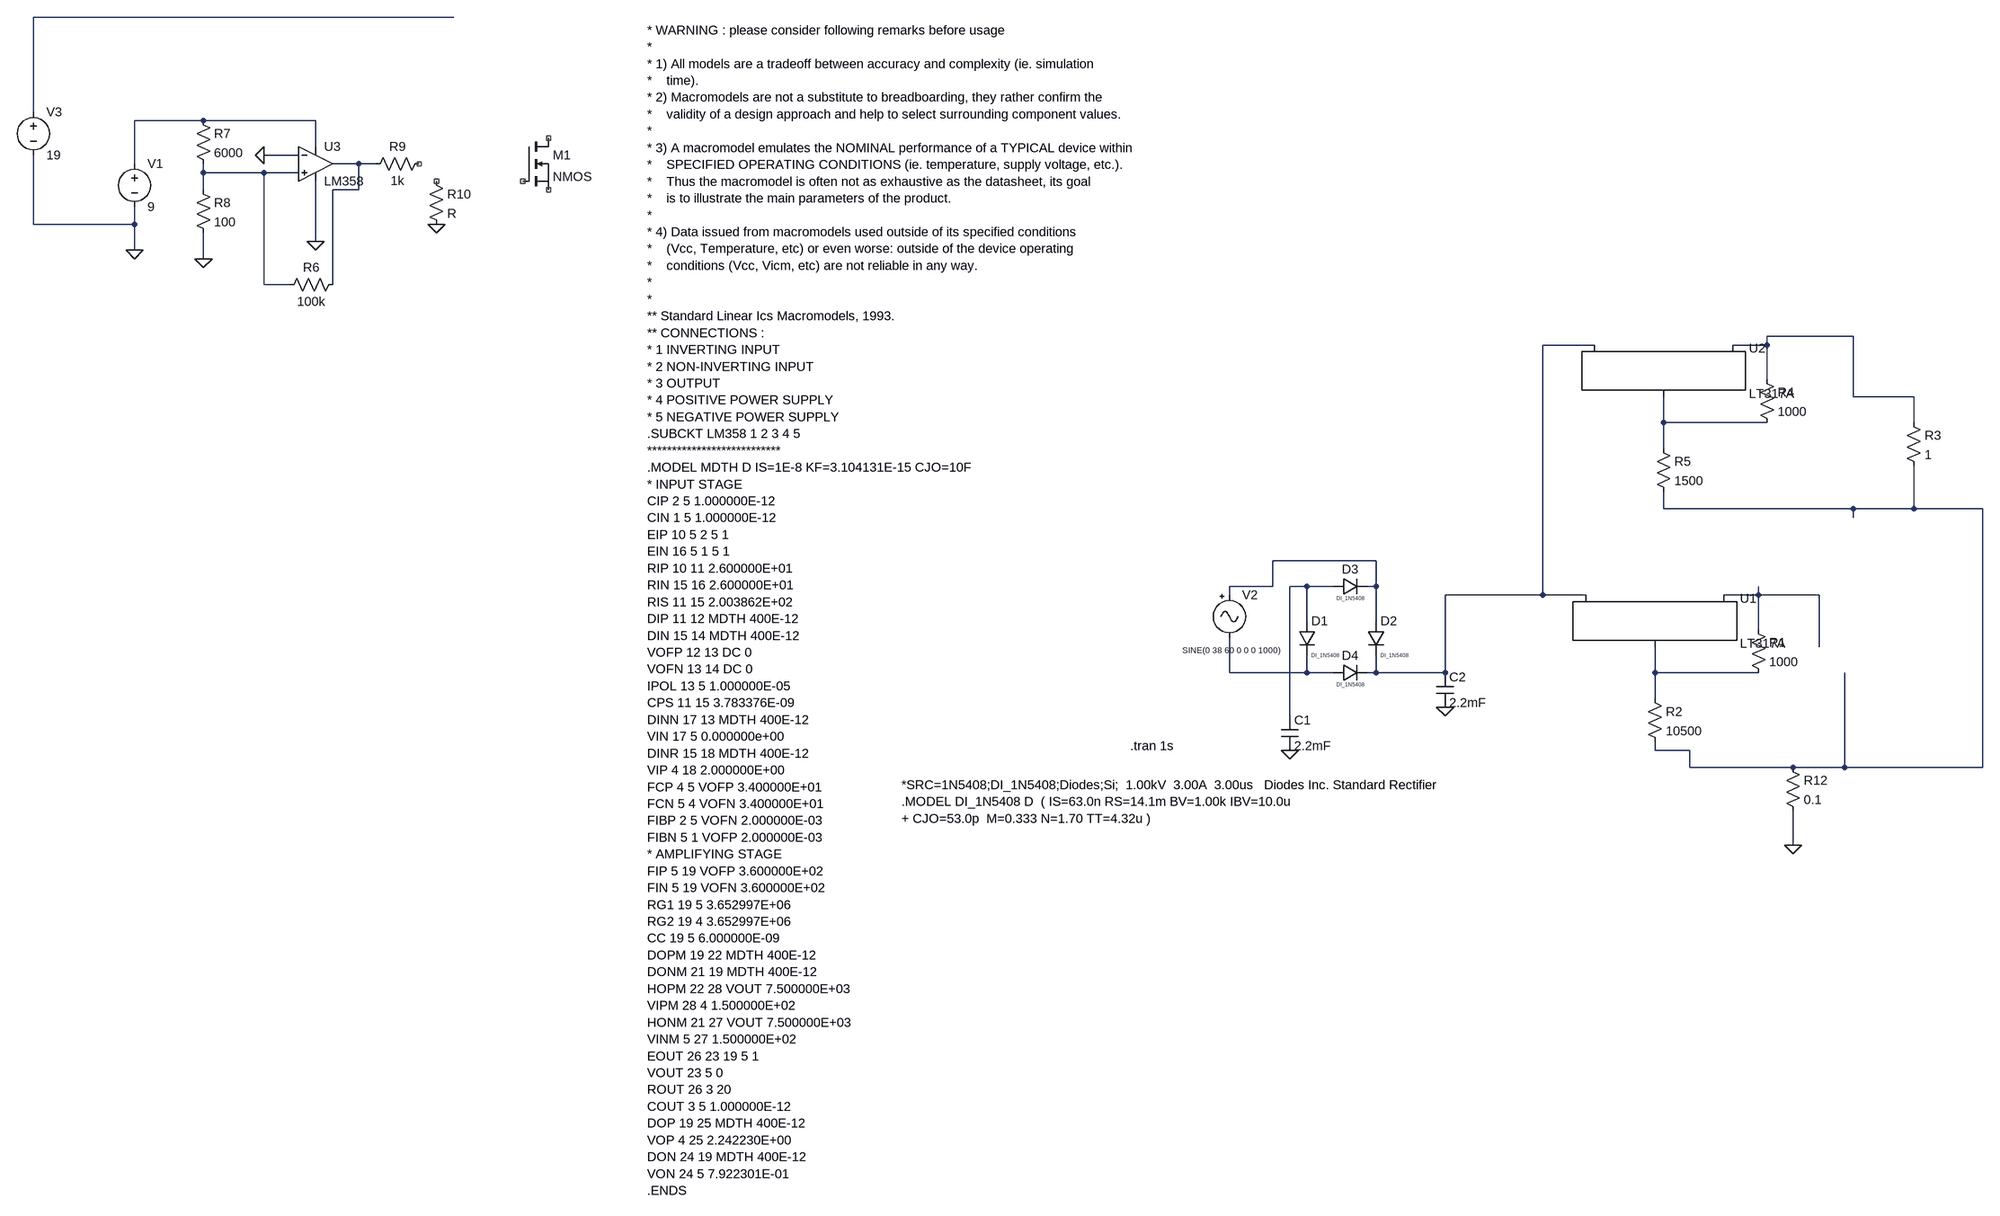
[diagram p0: schematic EjemploEstrella.asc]
EjemploEstrella.asc, the LTspice schematic file:
Version 4.1
SHEET 1 880 680
WIRE -2752 -1296 -3568 -1296
WIRE -3568 -1120 -3568 -1296
WIRE -3216 -1104 -3344 -1104
WIRE -3008 -1104 -3216 -1104
WIRE -3008 -1056 -3008 -1104
WIRE -3040 -1040 -3104 -1040
WIRE -3344 -1024 -3344 -1104
WIRE -2928 -1024 -2976 -1024
WIRE -2896 -1024 -2928 -1024
WIRE -3216 -1008 -3216 -1024
WIRE -3104 -1008 -3216 -1008
WIRE -3040 -1008 -3104 -1008
WIRE -3216 -976 -3216 -1008
WIRE -2928 -976 -2928 -1024
WIRE -2928 -976 -2976 -976
WIRE -3568 -912 -3568 -1040
WIRE -3344 -912 -3344 -944
WIRE -3344 -912 -3568 -912
WIRE -3008 -880 -3008 -992
WIRE -3344 -864 -3344 -912
WIRE -3216 -848 -3216 -896
WIRE -3104 -800 -3104 -1008
WIRE -3056 -800 -3104 -800
WIRE -2976 -800 -2976 -976
WIRE 224 -704 64 -704
WIRE -256 -688 -352 -688
WIRE 64 -688 64 -704
WIRE 64 -688 0 -688
WIRE 64 -624 64 -688
WIRE 224 -592 224 -704
WIRE 336 -592 224 -592
WIRE -128 -544 -128 -592
WIRE 64 -544 -128 -544
WIRE 336 -544 336 -592
WIRE -128 -496 -128 -544
WIRE -128 -384 -128 -416
WIRE 224 -384 -128 -384
WIRE 336 -384 336 -464
WIRE 336 -384 224 -384
WIRE 464 -384 336 -384
WIRE 224 -368 224 -384
WIRE -928 -288 -1120 -288
WIRE -1120 -240 -1120 -288
WIRE -1120 -240 -1200 -240
WIRE -1056 -240 -1088 -240
WIRE -1008 -240 -1056 -240
WIRE -928 -240 -928 -288
WIRE -928 -240 -944 -240
WIRE -1200 -224 -1200 -240
WIRE -352 -224 -352 -688
WIRE -352 -224 -800 -224
WIRE -272 -224 -352 -224
WIRE 48 -224 48 -240
WIRE 48 -224 -16 -224
WIRE 160 -224 48 -224
WIRE -1056 -176 -1056 -240
WIRE -928 -176 -928 -240
WIRE 48 -160 48 -224
WIRE 160 -128 160 -224
WIRE -1200 -80 -1200 -144
WIRE -1056 -80 -1056 -112
WIRE -1056 -80 -1200 -80
WIRE -1008 -80 -1056 -80
WIRE -928 -80 -928 -112
WIRE -928 -80 -944 -80
WIRE -800 -80 -800 -224
WIRE -800 -80 -928 -80
WIRE -144 -80 -144 -128
WIRE 48 -80 -144 -80
WIRE -144 -32 -144 -80
WIRE -1088 0 -1088 -240
WIRE -144 64 -144 48
WIRE -80 64 -144 64
WIRE -80 96 -80 64
WIRE 112 96 -80 96
WIRE 208 96 208 -80
WIRE 208 96 112 96
WIRE 464 96 464 -384
WIRE 464 96 208 96
WIRE 112 240 112 176
FLAG -1088 64 0
FLAG -800 -16 0
FLAG -3344 -864 0
FLAG -3216 -848 0
FLAG -3008 -880 0
FLAG 112 240 0
FLAG -3104 -1040 0
FLAG -2784 -912 0
SYMBOL diode -1072 -176 R0
WINDOW 3 24 64 Left 0
SYMATTR Value DI_1N5408
SYMATTR InstName D1
SYMBOL diode -944 -176 R0
WINDOW 3 24 64 Left 0
SYMATTR Value DI_1N5408
SYMATTR InstName D2
SYMBOL diode -1008 -224 R270
WINDOW 0 32 32 VTop 2
WINDOW 3 0 32 VBottom 0
SYMATTR InstName D3
SYMATTR Value DI_1N5408
SYMBOL diode -1008 -64 R270
WINDOW 0 32 32 VTop 2
WINDOW 3 0 32 VBottom 0
SYMATTR InstName D4
SYMATTR Value DI_1N5408
SYMBOL Misc\\signal -1200 -240 R0
WINDOW 3 4 129 Bottom 1
WINDOW 123 0 0 Left 0
WINDOW 39 0 0 Left 0
SYMATTR Value SINE(0 38 60 0 0 0 1000)
SYMATTR InstName V2
SYMBOL cap -816 -80 R0
SYMATTR InstName C2
SYMATTR Value 2.2mF
SYMBOL PowerProducts\\LT317A -144 -224 R0
SYMATTR InstName U1
SYMBOL res 32 -176 R0
SYMATTR InstName R1
SYMATTR Value 1000
SYMBOL res -160 -48 R0
SYMATTR InstName R2
SYMATTR Value 10500
SYMBOL cap -1104 0 R0
SYMATTR InstName C1
SYMATTR Value 2.2mF
SYMBOL PowerProducts\\LT317A -128 -688 R0
SYMATTR InstName U2
SYMBOL res 48 -640 R0
SYMATTR InstName R4
SYMATTR Value 1000
SYMBOL res -144 -512 R0
SYMATTR InstName R5
SYMATTR Value 1500
SYMBOL voltage -3344 -1040 R0
WINDOW 123 0 0 Left 0
WINDOW 39 0 0 Left 0
SYMATTR InstName V1
SYMATTR Value 9
SYMBOL res -3232 -1120 R0
SYMATTR InstName R7
SYMATTR Value 6000
SYMBOL res -3232 -992 R0
SYMATTR InstName R8
SYMATTR Value 100
SYMBOL voltage -3568 -1136 R0
WINDOW 123 0 0 Left 0
WINDOW 39 0 0 Left 0
SYMATTR InstName V3
SYMATTR Value 19
SYMBOL OpAmps\\opamp2 -3008 -1088 R0
SYMATTR InstName U3
SYMATTR Value LM358
SYMBOL res 96 80 R0
SYMATTR InstName R12
SYMATTR Value 0.1
SYMBOL res 320 -560 R0
SYMATTR InstName R3
SYMATTR Value 1
SYMBOL res -2960 -816 R90
WINDOW 0 0 56 VBottom 2
WINDOW 3 32 56 VTop 2
SYMATTR InstName R6
SYMATTR Value 100k
SYMBOL res -2800 -1040 R90
WINDOW 0 0 56 VBottom 2
WINDOW 3 32 56 VTop 2
SYMATTR InstName R9
SYMATTR Value 1k
SYMBOL res -2800 -1008 R0
SYMATTR InstName R10
SYMBOL nmos -2624 -1072 R0
SYMATTR InstName M1
TEXT -1384 56 Left 2 !.tran 1s
TEXT -1808 128 Left 2 !*SRC=1N5408;DI_1N5408;Diodes;Si;  1.00kV  3.00A  3.00us   Diodes Inc. Standard Rectifier \n.MODEL DI_1N5408 D  ( IS=63.0n RS=14.1m BV=1.00k IBV=10.0u \n+ CJO=53.0p  M=0.333 N=1.70 TT=4.32u )
TEXT -2280 -1272 Left 2 !* WARNING : please consider following remarks before usage\n*\n* 1) All models are a tradeoff between accuracy and complexity (ie. simulation \n*    time).\n* 2) Macromodels are not a substitute to breadboarding, they rather confirm the\n*    validity of a design approach and help to select surrounding component values.\n*\n* 3) A macromodel emulates the NOMINAL performance of a TYPICAL device within \n*    SPECIFIED OPERATING CONDITIONS (ie. temperature, supply voltage, etc.).\n*    Thus the macromodel is often not as exhaustive as the datasheet, its goal\n*    is to illustrate the main parameters of the product.\n*\n* 4) Data issued from macromodels used outside of its specified conditions\n*    (Vcc, Temperature, etc) or even worse: outside of the device operating \n*    conditions (Vcc, Vicm, etc) are not reliable in any way.\n*\n*\n** Standard Linear Ics Macromodels, 1993. \n** CONNECTIONS :\n* 1 INVERTING INPUT\n* 2 NON-INVERTING INPUT\n* 3 OUTPUT\n* 4 POSITIVE POWER SUPPLY\n* 5 NEGATIVE POWER SUPPLY\n.SUBCKT LM358 1 2 3 4 5\n***************************\n.MODEL MDTH D IS=1E-8 KF=3.104131E-15 CJO=10F\n* INPUT STAGE\nCIP 2 5 1.000000E-12\nCIN 1 5 1.000000E-12\nEIP 10 5 2 5 1\nEIN 16 5 1 5 1\nRIP 10 11 2.600000E+01\nRIN 15 16 2.600000E+01\nRIS 11 15 2.003862E+02\nDIP 11 12 MDTH 400E-12\nDIN 15 14 MDTH 400E-12\nVOFP 12 13 DC 0 \nVOFN 13 14 DC 0\nIPOL 13 5 1.000000E-05\nCPS 11 15 3.783376E-09\nDINN 17 13 MDTH 400E-12\nVIN 17 5 0.000000e+00\nDINR 15 18 MDTH 400E-12\nVIP 4 18 2.000000E+00\nFCP 4 5 VOFP 3.400000E+01\nFCN 5 4 VOFN 3.400000E+01\nFIBP 2 5 VOFN 2.000000E-03\nFIBN 5 1 VOFP 2.000000E-03\n* AMPLIFYING STAGE\nFIP 5 19 VOFP 3.600000E+02\nFIN 5 19 VOFN 3.600000E+02\nRG1 19 5 3.652997E+06\nRG2 19 4 3.652997E+06\nCC 19 5 6.000000E-09\nDOPM 19 22 MDTH 400E-12\nDONM 21 19 MDTH 400E-12\nHOPM 22 28 VOUT 7.500000E+03\nVIPM 28 4 1.500000E+02\nHONM 21 27 VOUT 7.500000E+03\nVINM 5 27 1.500000E+02\nEOUT 26 23 19 5 1\nVOUT 23 5 0\nROUT 26 3 20\nCOUT 3 5 1.000000E-12\nDOP 19 25 MDTH 400E-12\nVOP 4 25 2.242230E+00\nDON 24 19 MDTH 400E-12\nVON 24 5 7.922301E-01\n.ENDS

The netlist it stands for:
* EjemploEstrella.asc
D1 N010 N012 DI_1N5408
D2 N009 N006 DI_1N5408
D3 N010 N009 DI_1N5408
D4 N012 N006 DI_1N5408
V2 N009 N012 SINE(0 38 60 0 0 0 1000)
C2 N006 0 2.2mF
X§U1 N013 N011 N006 LT317A
R1 N011 N013 1000
R2 N013 N008 10500
C1 N010 0 2.2mF
X§U2 N007 N005 N006 LT317A
R4 N005 N007 1000
R5 N007 N008 1500
V1 N002 0 9
R7 N002 N004 6000
R8 N004 0 100
V3 N001 0 19
X§U3 N004 0 N002 0 N003 LM358  ; pins In+ In- V+ V- OUT
R12 N008 0 0.1
R3 N005 N008 1
R6 N003 N004 100k
R9 NC_01 N003 1k
R10 NC_02 0 R
M1 NC_03 NC_04 NC_05 NC_05 NMOS
.model D D
.lib standard.dio
.model NMOS NMOS
.model PMOS PMOS
.lib standard.mos
.tran 1s
*SRC=1N5408;DI_1N5408;Diodes;Si;  1.00kV  3.00A  3.00us   Diodes Inc. Standard Rectifier
.MODEL DI_1N5408 D  ( IS=63.0n RS=14.1m BV=1.00k IBV=10.0u
+ CJO=53.0p  M=0.333 N=1.70 TT=4.32u )
* WARNING : please consider following remarks before usage
*
* 1) All models are a tradeoff between accuracy and complexity (ie. simulation
*    time).
* 2) Macromodels are not a substitute to breadboarding, they rather confirm the
*    validity of a design approach and help to select surrounding component values.
*
* 3) A macromodel emulates the NOMINAL performance of a TYPICAL device within
*    SPECIFIED OPERATING CONDITIONS (ie. temperature, supply voltage, etc.).
*    Thus the macromodel is often not as exhaustive as the datasheet, its goal
*    is to illustrate the main parameters of the product.
*
* 4) Data issued from macromodels used outside of its specified conditions
*    (Vcc, Temperature, etc) or even worse: outside of the device operating
*    conditions (Vcc, Vicm, etc) are not reliable in any way.
*
*
** Standard Linear Ics Macromodels, 1993.
** CONNECTIONS :
* 1 INVERTING INPUT
* 2 NON-INVERTING INPUT
* 3 OUTPUT
* 4 POSITIVE POWER SUPPLY
* 5 NEGATIVE POWER SUPPLY
.SUBCKT LM358 1 2 3 4 5
***************************
.MODEL MDTH D IS=1E-8 KF=3.104131E-15 CJO=10F
* INPUT STAGE
CIP 2 5 1.000000E-12
CIN 1 5 1.000000E-12
EIP 10 5 2 5 1
EIN 16 5 1 5 1
RIP 10 11 2.600000E+01
RIN 15 16 2.600000E+01
RIS 11 15 2.003862E+02
DIP 11 12 MDTH 400E-12
DIN 15 14 MDTH 400E-12
VOFP 12 13 DC 0
VOFN 13 14 DC 0
IPOL 13 5 1.000000E-05
CPS 11 15 3.783376E-09
DINN 17 13 MDTH 400E-12
VIN 17 5 0.000000e+00
DINR 15 18 MDTH 400E-12
VIP 4 18 2.000000E+00
FCP 4 5 VOFP 3.400000E+01
FCN 5 4 VOFN 3.400000E+01
FIBP 2 5 VOFN 2.000000E-03
FIBN 5 1 VOFP 2.000000E-03
* AMPLIFYING STAGE
FIP 5 19 VOFP 3.600000E+02
FIN 5 19 VOFN 3.600000E+02
RG1 19 5 3.652997E+06
RG2 19 4 3.652997E+06
CC 19 5 6.000000E-09
DOPM 19 22 MDTH 400E-12
DONM 21 19 MDTH 400E-12
HOPM 22 28 VOUT 7.500000E+03
VIPM 28 4 1.500000E+02
HONM 21 27 VOUT 7.500000E+03
VINM 5 27 1.500000E+02
EOUT 26 23 19 5 1
VOUT 23 5 0
ROUT 26 3 20
COUT 3 5 1.000000E-12
DOP 19 25 MDTH 400E-12
VOP 4 25 2.242230E+00
DON 24 19 MDTH 400E-12
VON 24 5 7.922301E-01
.ENDS
.lib LTC.lib
.backanno
.end